# Altium project AQCA-Light-Module-A0.PrjPcb
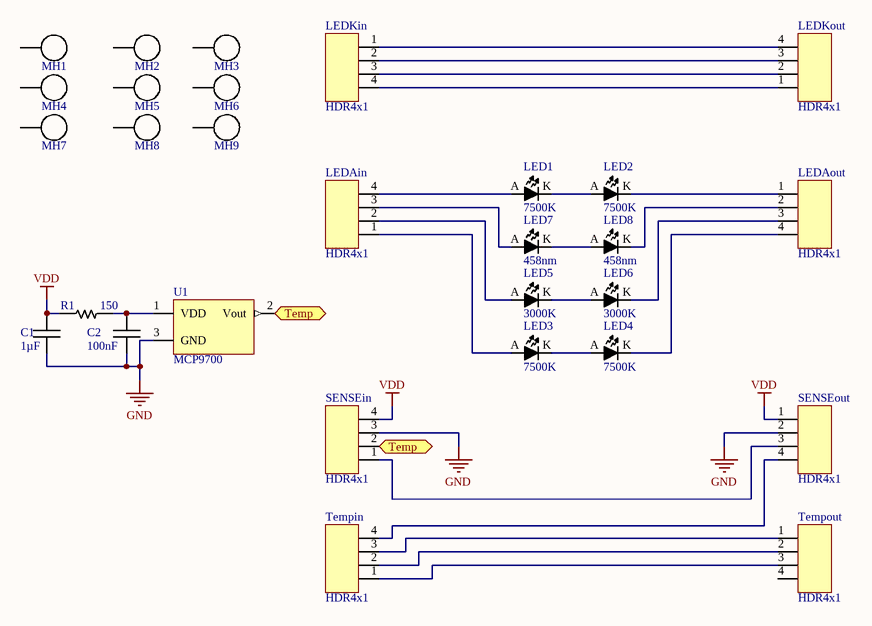
[diagram p0: AQCA-Light-Module-A0.SchDoc]
1 sheet, 29 parts. Net scope: flat (ports and power ports of the same name join across sheets).
Board file: AQCA-Light-Module-A0.PcbDoc

## Sheet AQCA-Light-Module-A0.SchDoc
size A4

### Parts
C1  1µF  [CAPC1608N]
C2  100nF  [CAPC1608N]
LED1  7500K  [LED XP-E]
LED2  7500K  [LED XP-E]
LED3  7500K  [LED XP-E]
LED4  7500K  [LED XP-E]
LED5  3000K  [LED XB-D]
LED6  3000K  [LED XB-D]
LED7  458nm  [LED XT-E]
LED8  458nm  [LED XT-E]
LEDAin  HDR4x1  [HDR4x1 EDGE male]
LEDAout  HDR4x1  [HDR4x1 EDGE female]
LEDKin  HDR4x1  [HDR4x1 EDGE male]
LEDKout  HDR4x1  [HDR4x1 EDGE female]
MH1  Mounting Hole  [Mount Hole 4-6.5]  (value not drawn)
MH2  Mounting Hole  [Mount Hole 4-6.5]  (value not drawn)
MH3  Mounting Hole  [Mount Hole 4-6.5]  (value not drawn)
MH4  Mounting Hole  [Mount Hole 4-6.5]  (value not drawn)
MH5  Mounting Hole  [Mount Hole 4-6.5]  (value not drawn)
MH6  Mounting Hole  [Mount Hole 4-6.5]  (value not drawn)
MH7  Mounting Hole  [Mount Hole 4-6.5]  (value not drawn)
MH8  Mounting Hole  [Mount Hole 4-6.5]  (value not drawn)
MH9  Mounting Hole  [Mount Hole 4-6.5]  (value not drawn)
R1  150  [RESC1608N]
SENSEin  HDR4x1  [HDR4x1 EDGE male]
SENSEout  HDR4x1  [HDR4x1 EDGE female]
Tempin  HDR4x1  [HDR4x1 EDGE male]
Tempout  HDR4x1  [HDR4x1 EDGE female]
U1  MCP9700  [SOT23-3N]

### Ports
Temp

### Nets
GND: C1.1 C2.1 SENSEin.3 SENSEout.2 U1.3(GND)
VDD: C1.2 R1.1 SENSEin.4 SENSEout.1
NetC2_2: C2.2 R1.2 U1.1(VDD)
NetLED1_A: LED1.A LEDAin.4
NetLED1_K: LED1.K LED2.A
NetLED2_K: LED2.K LEDAout.1
NetLED3_A: LED3.A LEDAin.1
NetLED3_K: LED3.K LED4.A
NetLED4_K: LED4.K LEDAout.4
NetLED5_A: LED5.A LEDAin.2
NetLED5_K: LED5.K LED6.A
NetLED6_K: LED6.K LEDAout.3
NetLED7_A: LED7.A LEDAin.3
NetLED7_K: LED7.K LED8.A
NetLED8_K: LED8.K LEDAout.2
NetLEDKin_1: LEDKin.1 LEDKout.4
NetLEDKin_2: LEDKin.2 LEDKout.3
NetLEDKin_3: LEDKin.3 LEDKout.2
NetLEDKin_4: LEDKin.4 LEDKout.1
NetSENSEin_1: SENSEin.1 SENSEout.3
NetSENSEin_2: SENSEin.2 U1.2(Vout) ; port Temp
NetSENSEout_4: SENSEout.4 Tempin.4
NetTempin_1: Tempin.1 Tempout.3
NetTempin_2: Tempin.2 Tempout.2
NetTempin_3: Tempin.3 Tempout.1

Not connected (* = marked no-connect by the designer): MH1 1; MH2 1; MH3 1; MH4 1; MH5 1; MH6 1; MH7 1; MH8 1; MH9 1; Tempout 4

### Library data of the parts
C1 = Capacitor: Voltage: 25V; Value: 1µF
C2 = Capacitor: Value: 100nF
LED1-LED8 = LED
  LED1-LED4: Color: 7500K
  LED5 LED6: Color: 3000K
  LED7 LED8: Color: 458nm
R1 = Resistor: Value: 150